# Altium schematic sheet FLYBACK_SWITCHING_POWER_SUPPLY_V1_2.SchDoc
size A4; SheetNumber: 1; SheetTotal: 1
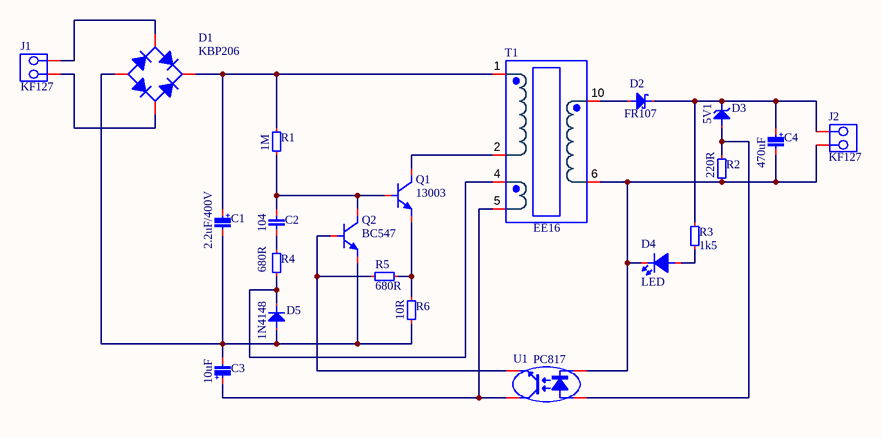
[diagram p0: FLYBACK_SWITCHING_POWER_SUPPLY_V1_2.SchDoc]

## Parts
C1  2.2uF/400V  [CAP_RAD_D10x12.5]
C2  104  [CAP_Ceramic_2.5MM]
C3  10uF  [CAP_RAD_D05x11]
C4  470uF  [CAP_RAD_D06.3x11]
D1  KBP206  [DIODE-KBP206]
D2  FR107  [DO-204AL-BK]
D3  5V1  [DO-204AL-RD]
D4  LED  [LED_5MM]
D5  1N4148  [DO-204AH-RD]
J1  KF127  [DG127-5.0-02P-14-00AH]
J2  KF127  [DG127-5.0-02P-14-00AH]
Q1  13003  [TO-126]
Q2  BC547  [TO-92]
R1  1M  [RES-0.25W-H]
R2  220R  [RES-0.25W-H]
R3  1k5  [RES-0.25W-H]
R4  680R  [RES-0.25W-H]
R5  680R  [RES-0.25W-H]
R6  10R  [RES-0.5W-V]
T1  EE16  [TRANSFORMERS-EE16(5+5)-H]
U1  PC817  [PC817-DIP]

## Nets
NetC1_1: C1.1 D1.1(+) R1.2 T1.1
NetC1_2: C1.2 C3.2 D1.4(-) D5.1 Q2.3(E) R6.2
NetC2_1: C2.1 R4.2
NetC2_2: C2.2 Q1.1(B) Q2.1(C) R1.1
NetC3_1: C3.1 T1.5 U1.4(C)
NetC4_1: C4.1 D2.2 D3.2 J2.1 R3.2
NetC4_2: C4.2 D4.2(K) J2.2 R2.2 T1.6 U1.2(K)
NetD1_2: D1.2(AC) J1.2
NetD1_3: D1.3(AC) J1.1
NetD2_1: D2.1 T1.10
NetD3_1: D3.1 R2.1 U1.1(A)
NetD4_1: D4.1(A) R3.1
NetD5_2: D5.2 R4.1 T1.4
NetQ1_2: Q1.2(C) T1.2
NetQ1_3: Q1.3(E) R5.1 R6.1
NetQ2_2: Q2.2(B) R5.2 U1.3(E)

## Notes on the sheet
- (in symbol Capacitor(Radian)) +

## Library data of the parts
C1 C3 C4 = Capacitor(Radian)
C2 = Capacitors(Disc)
D1 = Diode-KBP206
D2 = Diode-FR107: 1A 1000V
D3 = Diode-Zener
D4 = LED 5MM
D5 = Diode-1N4148: The fast switching diode
J1 J2 = DG127-5.0-02P-14-00AH
Q1 = Transistor-MJE13003
Q2 = Transistor-BC547: VCEO: 45 Vdc / VCBO: 50 Vdc / VEBO: 6.0 Vdc
R1-R6 = Resistors THD
T1 = TRANS-EE16-HORIZONTAL(5+5)
U1 = Opto-PC817